# Altium schematic sheet Power Conversion.SchDoc
size Letter portrait; DocumentNumber: 1; SheetNumber: 1; SheetTotal: 13
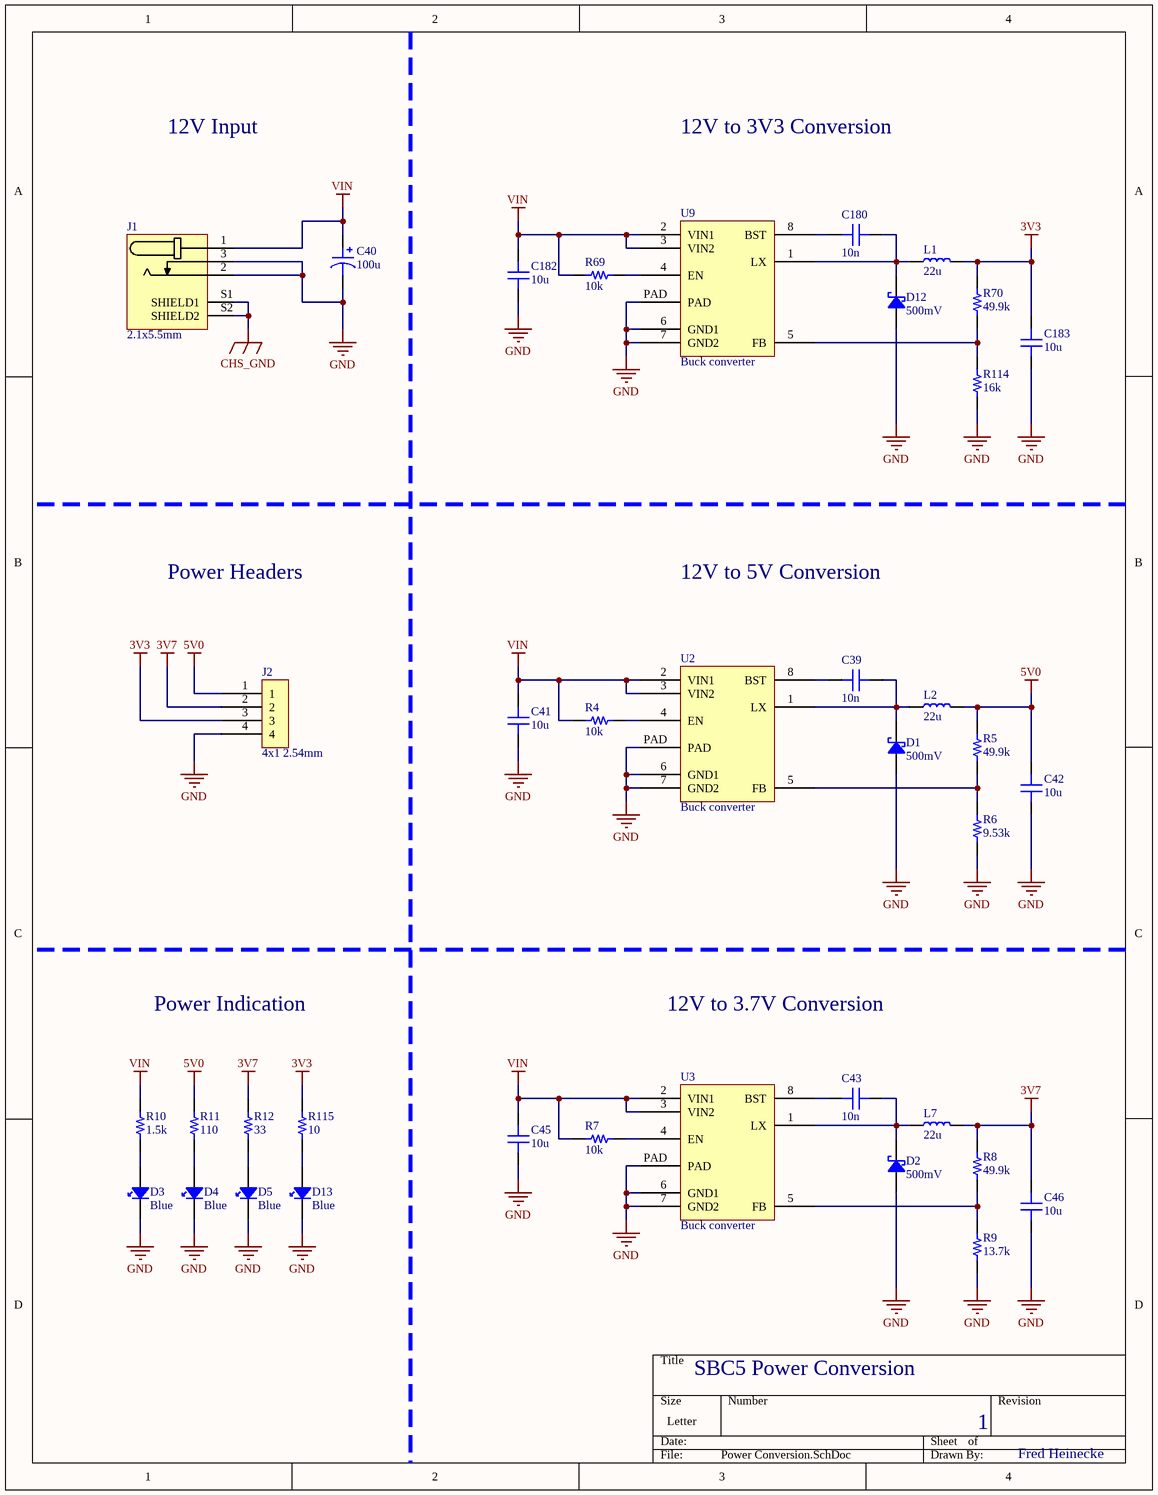
[diagram p0: Power Conversion.SchDoc]

## Parts
C39  10n  [C0402]
C40  100u  [C8x11.5x3.5]
C41  10u  [C0805]
C42  10u  [C0805]
C43  10n  [C0402]
C45  10u  [C0805]
C46  10u  [C0805]
C180  10n  [C0402]
C182  10u  [C0805]
C183  10u  [C0805]
D1  500mV  [SOD-123]
D2  500mV  [SOD-123]
D3  Blue  [D0603]
D4  Blue  [D0603]
D5  Blue  [D0603]
D12  500mV  [SOD-123]
D13  Blue  [D0603]
J1  2.1x5.5mm  [PJ-047AH]
J2  4x1 2.54mm  [PH1-04-UA]
L1  22u  [MPL-SE4030-220]
L2  22u  [MPL-SE4030-220]
L7  22u  [MPL-SE4030-220]
R4  10k  [R0201]
R5  49.9k  [R0603]
R6  9.53k  [R0603]
R7  10k  [R0201]
R8  49.9k  [R0603]
R9  13.7k  [R0603]
R10  1.5k  [R0402]
R11  110  [R0402]
R12  33  [R0402]
R69  10k  [R0201]
R70  49.9k  [R0603]
R114  16k  [R0603]
R115  10  [R0402]
U2  Buck converter  [AOZ1281DI]
U3  Buck converter  [AOZ1281DI]
U9  Buck converter  [AOZ1281DI]

## Nets
3V3: C183.2 J2.3 L1.2 R70.2 R115.2
3V7: C46.2 J2.2 L7.2 R8.2 R12.2
5V0: C42.2 J2.1 L2.2 R5.2 R11.2
CHS_GND: J1.S1(SHIELD1) J1.S2(SHIELD2)
GND: C40.2 C41.1 C42.1 C45.1 C46.1 C182.1 C183.1 D1.2 D2.2 D3.K D4.K D5.K D12.2 D13.K J1.2 J1.3 J2.4 R6.1 R9.1 R114.1 U2.6(GND1) U2.7(GND2) U2.PAD U3.6(GND1) U3.7(GND2) U3.PAD U9.6(GND1) U9.7(GND2) U9.PAD
VIN: C40.1 C41.2 C45.2 C182.2 J1.1 R4.1 R7.1 R10.2 R69.1 U2.2(VIN1) U2.3(VIN2) U3.2(VIN1) U3.3(VIN2) U9.2(VIN1) U9.3(VIN2)
NetC39_1: C39.1 U2.8(BST)
NetC39_2: C39.2 D1.1 L2.1 U2.1(LX)
NetC43_1: C43.1 U3.8(BST)
NetC43_2: C43.2 D2.1 L7.1 U3.1(LX)
NetC180_1: C180.1 U9.8(BST)
NetC180_2: C180.2 D12.1 L1.1 U9.1(LX)
NetD3_A: D3.A R10.1
NetD4_A: D4.A R11.1
NetD5_A: D5.A R12.1
NetD13_A: D13.A R115.1
NetR4_2: R4.2 U2.4(EN)
NetR5_1: R5.1 R6.2 U2.5(FB)
NetR7_2: R7.2 U3.4(EN)
NetR8_1: R8.1 R9.2 U3.5(FB)
NetR69_2: R69.2 U9.4(EN)
NetR70_1: R70.1 R114.2 U9.5(FB)

## Notes on the sheet
- 12V Input
- 12V to 3V3 Conversion
- Power Headers
- 12V to 5V Conversion
- Power Indication
- 12V to 3.7V Conversion
- SBC5 Power Conversion
- 1
- Fred Heinecke

## Library data of the parts
C39 C43 C180 = CL05B103KO5NNNC: SAMSUNG ELECTRO-MECHANICS - CL05B103KO5NNNC - SMD Multilayer Ceramic Capacitor, 0.01 µF, 16 V, 0402 [1005 Metric], ± 10%, X7R, CL Series; Capacitance: 10nF; Voltage Rating: 16V; Supplier 1: Digi-Key; Supplier Part Number 1: 1276-1051-1-ND; Manufacturer: Samsung; Manufacturer Part Number: CL05B103KO5NNNC; RoHS: Yes; Category: Ceramic Capacitors; Stock 1: 2979671; Pricing 1: 1=0.10000, 10=0.01600, 50=0.00880, 100=0.00710, 500=0.00508, 1000=0.00399, 2500=0.00363, 5000=0.00334 (USD); Mount: Surface Mount; Case/Package: 0402; Case Code (Metric): 1005; Case Code (Imperial): 0402; Material: Ceramic; Min Operating Temperature: -55°C; Max Operating Temperature: 125°C; Tolerance: 10%; Dielectric: X7R; Package Quantity: 1; Packaging: Tape and Reel; Voltage: 16V; Series: CL; Construction: Flat; Length: 1mm; Width: 0.02inch; Height: 0.5mm; Thickness: 0.022inch; Depth: 0.5mm; Radiation Hardening: No; RoHS Compliant: Yes; ComponentLink1URL: https://datasheet.ciiva.com/16199/cl05b103ko5nnnc-16199040.pdf?src-supplier=Future+Electronics; ComponentLink1Description: https://datasheet.ciiva.com/16199/cl05b103ko5nnnc-16199040.pdf?src-supplier=Future+Electronics; ComponentLink2URL: https://datasheet.ciiva.com/15195/getdatasheetpartid-358673-15195638.pdf?src-supplier=Verical; ComponentLink2Description: https://datasheet.ciiva.com/15195/getdatasheetpartid-358673-15195638.pdf?src-supplier=Verical; ComponentLink3URL: https://datasheet.ciiva.com/29198/458774-da-01-en-vs-kondensator-0402-29198435.pdf?src-supplier=Conrad; ComponentLink3Description: https://datasheet.ciiva.com/29198/458774-da-01-en-vs-kondensator-0402-29198435.pdf?src-supplier=Conrad; ComponentLink4URL: https://datasheet.ciiva.com/25806/cl05b103ko5nnnc-25806933.pdf?src-supplier=Digi-Key; ComponentLink4Description: https://datasheet.ciiva.com/25806/cl05b103ko5nnnc-25806933.pdf?src-supplier=Digi-Key
C40 = EEU-FM1H101: PANASONIC ELECTRONIC COMPONENTS - EEUFM1H101 - CAP, ALU ELEC, 100UF, 50V, RAD; Ripple Current: 870mA; Tolerance: 20%; Life (Hours): 3000Hour; ESR (Equivalent Series Resistance): 61mR; Polarity: Polar; Dissipation Factor: 0.1%; Lead Diameter: 0.6mm; Supplier 1: Newark; Manufacturer: Panasonic; Manufacturer Part Number: EEU-FM1H101; RoHS: Yes; Category: Aluminum Electrolytic Capacitors; Stock 1: 5906; Pricing 1: 1=0.42000, 10=0.29500, 50=0.20660, 100=0.17700, 500=0.13278, 1000=0.11212, 2500=0.10622, 5000=0.10032 (USD); Mount: Through Hole,PCB; Case/Package: Radial; Contact Plating: Tin; Min Operating Temperature: -40°C; Max Operating Temperature: 105°C; Capacitance: 100uF; Termination: Radial; Packaging: Bulk; Voltage Rating (DC): 50V; Package Quantity: 200; Voltage Rating: 50V; Impedance: 61mR; Voltage: 50V; Diameter: 8mm; Length: 11.5mm; Height: 11.5mm; Lead Pitch: 3.5mm; Height - Seated (Max): 0.512inch; Radiation Hardening: No; Lead Free: Lead Free; REACH SVHC: No SVHC; ComponentLink1URL: https://datasheet.ciiva.com/19479/1985569-19479304.pdf?src-supplier=Jameco; ComponentLink1Description: https://datasheet.ciiva.com/19479/1985569-19479304.pdf?src-supplier=Jameco; ComponentLink2URL: https://datasheet.ciiva.com/11777/0900766b805f3abe-11777837.pdf?src-supplier=RSComponents; ComponentLink2Description: https://datasheet.ciiva.com/11777/0900766b805f3abe-11777837.pdf?src-supplier=RSComponents; ComponentLink3URL: https://datasheet.ciiva.com/43454/1678946-43454655.pdf?src-supplier=Farnell; ComponentLink3Description: https://datasheet.ciiva.com/43454/1678946-43454655.pdf?src-supplier=Farnell; ComponentLink4URL: https://datasheet.ciiva.com/2984/aba0000ce108-2984065.pdf?src-supplier=Avnet; ComponentLink4Description: https://datasheet.ciiva.com/2984/aba0000ce108-2984065.pdf?src-supplier=Avnet; ComponentLink5URL: https://datasheet.ciiva.com/93/aba0000ce108-93030.pdf?src-supplier=Digi-Key; ComponentLink5Description: https://datasheet.ciiva.com/93/aba0000ce108-93030.pdf?src-supplier=Digi-Key; ComponentLink6URL: https://datasheet.ciiva.com/25899/aba0000ce108-25899433.pdf?src-supplier=Avnet+Europe; ComponentLink6Description: https://datasheet.ciiva.com/25899/aba0000ce108-25899433.pdf?src-supplier=Avnet+Europe; ComponentLink7URL: https://datasheet.ciiva.com/30233/aba0000ce108-30233323.pdf?src-supplier=Onlinecomponents.com; ComponentLink7Description: https://datasheet.ciiva.com/30233/aba0000ce108-30233323.pdf?src-supplier=Onlinecomponents.com; ComponentLink8URL: https://datasheet.ciiva.com/18442/70068540-18442844.pdf?src-supplier=Allied+Electronics; ComponentLink8Description: https://datasheet.ciiva.com/18442/70068540-18442844.pdf?src-supplier=Allied+Electronics; ComponentLink9URL: https://datasheet.ciiva.com/3773/41677975s7076861n1386-3773626.pdf?src-supplier=Arrow+Electronics; ComponentLink9Description: https://datasheet.ciiva.com/3773/41677975s7076861n1386-3773626.pdf?src-supplier=Arrow+Electronics; Supplier Part Number 1: 62W7950
C41 C42 C45 C46 C182 C183 = CL21A106KOQNNNE: SAMSUNG ELECTRO-MECHANICS - CL21A106KOQNNNE - SMD Multilayer Ceramic Capacitor, 10 µF, 16 V, 0805 [2012 Metric], ± 10%, X5R, CL Series; Capacitance: 10uF; Voltage Rating: 16V; Dielectric: X7R; Supplier 1: Digi-Key; Supplier Part Number 1: 1276-1096-1-ND; Manufacturer: Samsung; Manufacturer Part Number: CL21A106KOQNNNE; RoHS: Yes; Category: Ceramic Capacitors; Stock 1: 1393610; Pricing 1: 1=0.12000, 10=0.09000, 50=0.04900, 100=0.04000, 500=0.02860, 1000=0.02248 (USD); Mount: Surface Mount; Case/Package: 0805; Case Code (Metric): 2012; Case Code (Imperial): 0805; Min Operating Temperature: -55°C; Max Operating Temperature: 85°C; Package Quantity: 1; Packaging: Tape and Reel; Tolerance: 10%; Voltage Rating (DC): 16V; Series: CL; Construction: Flat; Voltage: 16V; Length: 2mm; Width: 0.049inch; Height: 1.25mm; Thickness: 0.055inch; Depth: 1.25mm; Radiation Hardening: No; Lead Free: Lead Free; RoHS Compliant: Yes; ComponentLink1URL: https://datasheet.ciiva.com/15216/getdatasheetpartid-358435-15216234.pdf?src-supplier=Verical; ComponentLink1Description: https://datasheet.ciiva.com/15216/getdatasheetpartid-358435-15216234.pdf?src-supplier=Verical; ComponentLink2URL: https://datasheet.ciiva.com/25798/cl21a106koqnnne-25798133.pdf?src-supplier=Digi-Key; ComponentLink2Description: https://datasheet.ciiva.com/25798/cl21a106koqnnne-25798133.pdf?src-supplier=Digi-Key; ComponentLink3URL: https://datasheet.ciiva.com/16740/cl05b104kq5nnnc-16740697.pdf?src-supplier=Future+Electronics; ComponentLink3Description: https://datasheet.ciiva.com/16740/cl05b104kq5nnnc-16740697.pdf?src-supplier=Future+Electronics
D1 D2 D12 = MBR230LSTR: Diode Schottky 30V 2A SOD123; Manufacturer: SMC; Supplier 1: Digi-Key; Supplier Part Number 1: 1655-2311-1-ND; Manufacturer Part Number: MBR230LSTR; RoHS: No; Stock 1: 21905; Pricing 1: 1=0.33000, 10=0.22900, 100=0.11180, 500=0.09322, 1000=0.06477 (USD); Mount: Surface Mount; Packaging: Tape and Reel; Max Reverse Voltage (DC): 30V; Average Rectified Current: 2A; ComponentLink1URL: http://www.smc-diodes.com/propdf/MBR230LS%20N1466%20REV.A.pdf?src-supplier=Digi-Key; ComponentLink1Description: http://www.smc-diodes.com/propdf/MBR230LS%20N1466%20REV.A.pdf?src-supplier=Digi-Key
D3-D5 D13 = 150060BS75000: WURTH ELEKTRONIK - 150060BS75000 - LED, Blau, Oberflächenmontage, 603, 30 mA, 3.2 V, 470 nm; Manufacturer: Wurth Electronics; Luminous Intensity: 145mcd; Forward Current: 30mA; Forward Voltage: 3.2V; Wavelength: 470nm; Viewing Angle: 140°; Lens Style: Clear,Rectangular; Test Current: 20mA; Supplier 1: Digi-Key; Supplier Part Number 1: 732-4966-1-ND; Manufacturer Part Number: 150060BS75000; RoHS: Yes; Category: LEDs; Stock 1: 49172; Pricing 1: 1=0.17000 (USD); Mount: Surface Mount; Case/Package: 0603; Color: Blue; Case Code (Metric): 1608; Case Code (Imperial): 0603; Min Operating Temperature: -40°C; Max Operating Temperature: 85°C; Package Quantity: 4000; Packaging: Cut Tape; Dominant Wavelength: 470nm; Length: 1.6mm; Width: 0.8mm; Height: 0.7mm; REACH SVHC: Unknown; RoHS Compliant: Yes; ComponentLink1URL: https://datasheet.ciiva.com/29563/150060bs75000-29563034.pdf?src-supplier=Digi-Key; ComponentLink1Description: https://datasheet.ciiva.com/29563/150060bs75000-29563034.pdf?src-supplier=Digi-Key; ComponentLink2URL: https://datasheet.ciiva.com/29279/759426-da-01-en-chipled-0603-w-kl-blau-150060bs75000-29279193.pdf?src-supplier=Conrad; ComponentLink2Description: https://datasheet.ciiva.com/29279/759426-da-01-en-chipled-0603-w-kl-blau-150060bs75000-29279193.pdf?src-supplier=Conrad; ComponentLink3URL: https://datasheet.ciiva.com/29563/150060bs75000-29563035.pdf?src-supplier=Digi-Key; ComponentLink3Description: https://datasheet.ciiva.com/29563/150060bs75000-29563035.pdf?src-supplier=Digi-Key; ComponentLink4URL: https://datasheet.ciiva.com/22656/1911343-22656939.pdf?src-supplier=Element14; ComponentLink4Description: https://datasheet.ciiva.com/22656/1911343-22656939.pdf?src-supplier=Element14; ComponentLink5URL: https://datasheet.ciiva.com/29563/150060bs75000-29563036.pdf?src-supplier=Digi-Key; ComponentLink5Description: https://datasheet.ciiva.com/29563/150060bs75000-29563036.pdf?src-supplier=Digi-Key; ComponentLink6URL: https://datasheet.ciiva.com/48430/150060bs75000-eng-tds-48430039.pdf?src-supplier=Distrelec; ComponentLink6Description: https://datasheet.ciiva.com/48430/150060bs75000-eng-tds-48430039.pdf?src-supplier=Distrelec
J1 = PJ-047AH: CONN PWR JACK 2.1X5.5MM SOLDER; Manufacturer: CUI; Gender: Male; Shielding: Shielded; Current Rating: 5A; Number of Conductors: 2; Voltage Rating: 24V; Insulation Resistance: 100MR; Supplier 1: Digi-Key; Supplier Part Number 1: CP-047AH-ND; Manufacturer Part Number: PJ-047AH; RoHS: Yes; Category: Connectors; Stock 1: 4559; Pricing 1: 1=0.80000, 10=0.70100, 25=0.66000, 50=0.63260, 100=0.60500, 250=0.55000, 500=0.49500, 1000=0.44000, 2500=0.39875 (USD); Mount: Through Hole; Color: Black; Contact Material: Copper,Brass; Contact Plating: Nickel; Housing Color: Black; Housing Material: Thermoplastic; Min Operating Temperature: -25°C; Max Operating Temperature: 85°C; Termination: Solder; Connector Type: Jack; Package Quantity: 500; Contact Gender: Male; Orientation: Horizontal; Series: -; Lead Free: Lead Free; Flammability Rating: UL94 V-0; RoHS Compliant: Yes; ComponentLink1URL: http://www.mouser.com/ds/2/670/PJ-047AH-524157.pdf?src-supplier=Mouser; ComponentLink1Description: http://www.mouser.com/ds/2/670/PJ-047AH-524157.pdf?src-supplier=Mouser; ComponentLink2URL: https://www.cui.com/product/resource/digikeypdf/pj-047ah.pdf?src-supplier=Digi-Key; ComponentLink2Description: https://www.cui.com/product/resource/digikeypdf/pj-047ah.pdf?src-supplier=Digi-Key; Supplier 2: Digi-Key; Supplier Part Number 2: CP-047A-ND; Supplier 3: Arrow Electronics; Supplier Part Number 3: PJ-047A; Supplier 4: Mouser; Supplier Part Number 4: 490-PJ-047A
J2 = PH1-04-UA: Conn Unshrouded Header HDR 4 POS 2.54mm Solder ST Thru-Hole Bag; Manufacturer: Adam Equipment; Number of Positions: 4; Supplier 1: Digi-Key; Supplier Part Number 1: 2057-PH1-04-UA-ND; Manufacturer Part Number: PH1-04-UA; RoHS: Yes; Category: Connectors; Stock 1: 1152; Pricing 1: 1=0.10000, 10=0.07200, 100=0.04440, 500=0.03672, 1000=0.03213, 5000=0.02754, 10000=0.02678 (USD); Termination: Through Hole; Pitch: 2.54mm; Lead Free: Lead Free; ComponentLink1URL: http://www.adam-tech.com/catalog/2010/page_292-295.pdf?src-supplier=Future+Electronics; ComponentLink1Description: http://www.adam-tech.com/catalog/2010/page_292-295.pdf?src-supplier=Future+Electronics; ComponentLink2Description: Datasheet; ComponentLink2URL: https://static6.arrow.com/aropdfconversion/683efa088b5c0b1a8da3df70e12f05ed3743b8bf/page_292.pdf; ComponentLink3Description: Mechanical drawing; ComponentLink3URL: http://www.adam-tech.com/upload/PH1-XX-UA.pdf
L1 L2 L7 = MPL-SE4030-220: FIXED IND 22UH 1.5A 219 MOHM SMD; Manufacturer: Monolithic Power Systems; Supplier 1: Digi-Key; Supplier Part Number 1: 1589-MPL-SE4030-220CT-ND; Manufacturer Part Number: MPL-SE4030-220; RoHS: No; ComponentLink1Description: Datasheet; ComponentLink1URL: https://www.monolithicpower.com/en/documentview/productdocument/index/version/2/document_type/Datasheet/lang/en/sku/MPL-SE4030-220/document_id/5899/; Supplier 2: Mouser; Supplier Part Number 2: 946-MPL-SE4030-220
R4 R7 R69 = RMCF0201FT10K0: RES 10K OHM 1% 1/20W 0201; Manufacturer: Stackpole Electronics; Max Power Dissipation: 50mW; Temperature Coefficient: 200ppm/°C; Resistance: 10kR; Supplier 1: Digi-Key; Manufacturer Part Number: RMCF0201FT10K0; RoHS: Yes; Category: Chip SMD Resistors; Stock 1: 1526173; Pricing 1: 1=0.10000, 10=0.02300, 100=0.00940, 1000=0.00424, 2500=0.00368, 5000=0.00304 (USD); Mount: Surface Mount; Case/Package: 0201; Contact Plating: Tin,Matte; Case Code (Imperial): 0201; Case Code (Metric): 0603; Min Operating Temperature: -55°C; Max Operating Temperature: 125°C; Resistor Type: Thick Film; Number of Terminations: 2; Packaging: Tape and Reel; Tolerance: 1%; Power Rating: 50mW; Length: 0.024inch; Width: 0.012inch; Height: 0.009inch; ComponentLink1URL: https://www.seielect.com/catalog/SEI-Packaging.pdf?src-supplier=Digi-Key; ComponentLink1Description: https://www.seielect.com/catalog/SEI-Packaging.pdf?src-supplier=Digi-Key; ComponentLink2URL: https://www.seielect.com/Catalog/SEI-RMCF_RMCP.pdf?src-supplier=Avnet+Asia; ComponentLink2Description: https://www.seielect.com/Catalog/SEI-RMCF_RMCP.pdf?src-supplier=Avnet+Asia; ComponentLink3URL: https://www.seielect.com/Catalog/SEI-RMCF_RMCP.pdf?src-supplier=Avnet; ComponentLink3Description: https://www.seielect.com/Catalog/SEI-RMCF_RMCP.pdf?src-supplier=Avnet; ComponentLink4URL: https://www.seielect.com/Catalog/SEI-RMCF_RMCP.pdf?src-supplier=Digi-Key; ComponentLink4Description: https://www.seielect.com/Catalog/SEI-RMCF_RMCP.pdf?src-supplier=Digi-Key; Supplier Part Number 1: RMCF0201FT10K0CT-ND
R5 R8 R70 = ERA-3AEB4992V: RES SMD 49.9KOHM 0.1% 1/10W 0603; Manufacturer: Panasonic; Resistance: 49.9kR; Temperature Coefficient: 25ppm/°C; Power Rating: 100mW; Voltage Rating: 75V; Supplier 1: Digi-Key; Manufacturer Part Number: ERA-3AEB4992V; RoHS: Yes; Category: Chip SMD Resistors; Stock 1: 25051; Pricing 1: 1=0.31000, 10=0.26000, 100=0.10150, 1000=0.04248, 2500=0.03894 (USD); Mount: Surface Mount; Case/Package: 0603; Number of Pins: 2; Contact Plating: Tin; Case Code (Metric): 1608; Case Code (Imperial): 0603; Min Operating Temperature: -55°C; Max Operating Temperature: 155°C; Tolerance: 0.1%; Resistor Type: Thin Film,Metal Film; Packaging: Tape and Reel; Package Quantity: 1; Number of Terminations: 2; Termination: SMD/SMT; Max Power Dissipation: 100mW; Voltage Rating (DC): 75V; Features: Automotive AEC-Q200; Length: 1.6mm; Width: 0.8mm; Height: 0.45mm; Depth: 0.8mm; Radiation Hardening: No; REACH SVHC: No SVHC; Military Standard: Not; Lead Free: Lead Free; ComponentLink1URL: https://datasheet.ciiva.com/11812/0900766b80eb1d8c-11812018.pdf?src-supplier=RSComponents; ComponentLink1Description: https://datasheet.ciiva.com/11812/0900766b80eb1d8c-11812018.pdf?src-supplier=RSComponents; ComponentLink2URL: https://datasheet.ciiva.com/29183/451874-da-01-en-widerstand-0603-era-29183904.pdf?src-supplier=Conrad; ComponentLink2Description: https://datasheet.ciiva.com/29183/451874-da-01-en-widerstand-0603-era-29183904.pdf?src-supplier=Conrad; ComponentLink3URL: https://datasheet.ciiva.com/5998/485442-5998330.pdf?src-supplier=Farnell; ComponentLink3Description: https://datasheet.ciiva.com/5998/485442-5998330.pdf?src-supplier=Farnell; ComponentLink4URL: https://datasheet.ciiva.com/7861/485442-7861691.pdf?src-supplier=Element14; ComponentLink4Description: https://datasheet.ciiva.com/7861/485442-7861691.pdf?src-supplier=Element14; ComponentLink5URL: https://datasheet.ciiva.com/5998/485442-5998334.pdf?src-supplier=Farnell; ComponentLink5Description: https://datasheet.ciiva.com/5998/485442-5998334.pdf?src-supplier=Farnell; ComponentLink6URL: https://datasheet.ciiva.com/30157/54aoa0000ce26-30157031.pdf?src-supplier=Onlinecomponents.com; ComponentLink6Description: https://datasheet.ciiva.com/30157/54aoa0000ce26-30157031.pdf?src-supplier=Onlinecomponents.com; ComponentLink7URL: https://datasheet.ciiva.com/5998/485442-5998332.pdf?src-supplier=Farnell; ComponentLink7Description: https://datasheet.ciiva.com/5998/485442-5998332.pdf?src-supplier=Farnell; ComponentLink8URL: https://datasheet.ciiva.com/46422/485442-46422700.pdf?src-supplier=Element14; ComponentLink8Description: https://datasheet.ciiva.com/46422/485442-46422700.pdf?src-supplier=Element14; Supplier Part Number 1: P49.9KDBCT-ND; Supplier 2: Arrow Electronics; Supplier Part Number 2: ERA-3AEB4992V; Supplier 3: Mouser; Supplier Part Number 3: 667-ERA-3AEB4992V
R6 = ERA-3AEB9531V: RES SMD 9.53KOHM 0.1% 1/10W 0603; Manufacturer: Panasonic; Temperature Coefficient: 25ppm/°C; Resistance: 9.53kR; Voltage Rating (DC): 75V; Power Rating: 100mW; Supplier 1: Digi-Key; Manufacturer Part Number: ERA-3AEB9531V; RoHS: Yes; Category: Chip SMD Resistors; Stock 1: 27415; Pricing 1: 1=0.31000, 10=0.26000, 100=0.10150, 1000=0.04248, 2500=0.03894 (USD); Mount: Surface Mount; Case/Package: 0603; Number of Pins: 2; Contact Plating: Tin; Case Code (Imperial): 0603; Case Code (Metric): 1608; Min Operating Temperature: -55°C; Max Operating Temperature: 155°C; Resistor Type: Metal Film,Thin Film; Tolerance: 0.1%; Number of Terminations: 2; Features: Automotive AEC-Q200; Voltage Rating: 75V; Package Quantity: 5000; Packaging: Tape and Reel; Max Power Dissipation: 100mW; Length: 1.6mm; Width: 0.8mm; Height: 0.45mm; Depth: 0.8mm; Radiation Hardening: No; Military Standard: Not; Lead Free: Lead Free; ComponentLink1URL: https://datasheet.ciiva.com/11811/0900766b80eb1d8c-11811912.pdf?src-supplier=RSComponents; ComponentLink1Description: https://datasheet.ciiva.com/11811/0900766b80eb1d8c-11811912.pdf?src-supplier=RSComponents; ComponentLink2URL: https://datasheet.ciiva.com/29184/452443-da-01-en-widerstand-0603-era-29184006.pdf?src-supplier=Conrad; ComponentLink2Description: https://datasheet.ciiva.com/29184/452443-da-01-en-widerstand-0603-era-29184006.pdf?src-supplier=Conrad; ComponentLink3URL: https://datasheet.ciiva.com/5987/485442-5987161.pdf?src-supplier=Farnell; ComponentLink3Description: https://datasheet.ciiva.com/5987/485442-5987161.pdf?src-supplier=Farnell; ComponentLink4URL: https://datasheet.ciiva.com/7829/485442-7829102.pdf?src-supplier=Element14; ComponentLink4Description: https://datasheet.ciiva.com/7829/485442-7829102.pdf?src-supplier=Element14; ComponentLink5URL: https://datasheet.ciiva.com/9194/aoa0000ce26-9194167.pdf?src-supplier=Avnet; ComponentLink5Description: https://datasheet.ciiva.com/9194/aoa0000ce26-9194167.pdf?src-supplier=Avnet; ComponentLink6URL: https://datasheet.ciiva.com/5987/485442-5987164.pdf?src-supplier=Farnell; ComponentLink6Description: https://datasheet.ciiva.com/5987/485442-5987164.pdf?src-supplier=Farnell; ComponentLink7URL: https://datasheet.ciiva.com/5987/485442-5987166.pdf?src-supplier=Farnell; ComponentLink7Description: https://datasheet.ciiva.com/5987/485442-5987166.pdf?src-supplier=Farnell; Supplier Part Number 1: P9.53KDBCT-ND
R9 = ERJ-PB3B1372V: RES SMD 13.7K OHM 0.1% 1/5W 0603; Manufacturer: Panasonic; Max Power Dissipation: 200mW; Temperature Coefficient: 50ppm/°C; Resistance: 13.7kR; Supplier 1: Digi-Key; Manufacturer Part Number: ERJ-PB3B1372V; RoHS: Yes; Category: Chip SMD Resistors; Stock 1: 5380; Pricing 1: 1=0.23000, 10=0.19100, 25=0.13920, 50=0.10100, 100=0.07480, 250=0.05744, 500=0.04524, 1000=0.03132 (USD); Case/Package: 0603; Case Code (Imperial): 0603; Case Code (Metric): 1608; Min Operating Temperature: -55°C; Max Operating Temperature: 155°C; Features: Automotive AEC-Q200; Tolerance: 0.1%; Packaging: Tape and Reel; Resistor Type: Thick Film; Number of Terminations: 2; Length: 0.063inch; Width: 0.032inch; Height - Seated (Max): 0.022inch; ComponentLink1URL: https://industrial.panasonic.com/cdbs/www-data/pdf/RDM0000/DMM0000COL5.pdf?src-supplier=Digi-Key; ComponentLink1Description: https://industrial.panasonic.com/cdbs/www-data/pdf/RDM0000/DMM0000COL5.pdf?src-supplier=Digi-Key; ComponentLink2URL: https://industrial.panasonic.com/sa/system/files/data/download/catalog/id_fixed-resistors_e_2.pdf?src-supplier=Digi-Key; ComponentLink2Description: https://industrial.panasonic.com/sa/system/files/data/download/catalog/id_fixed-resistors_e_2.pdf?src-supplier=Digi-Key; Supplier Part Number 1: P20100CT-ND
R10 = RMCF0402FT1K50: RES 1.5K OHM 1% 1/16W 0402; Manufacturer: Stackpole Electronics; Resistance: 1.5kR; Power Rating: 62.5mW; Max Power Dissipation: 63mW; Temperature Coefficient: 100ppm/°C; Supplier 1: Digi-Key; Supplier Part Number 1: RMCF0402FT1K50CT-ND; Manufacturer Part Number: RMCF0402FT1K50; RoHS: Yes; Category: Chip SMD Resistors; Stock 1: 378149; Pricing 1: 1=0.10000, 10=0.01300, 100=0.00530, 1000=0.00239, 2500=0.00207, 5000=0.00171 (USD); Mount: Surface Mount; Case/Package: 0402; Case Code (Imperial): 0402; Contact Plating: Tin,Matte; Case Code (Metric): 1005; Min Operating Temperature: -55°C; Max Operating Temperature: 155°C; Tolerance: 1%; Packaging: Tape and Reel; Resistor Type: Thick Film; Number of Terminations: 2; Features: Automotive AEC-Q200; Length: 0.039inch; Width: 0.02inch; Height: 0.016inch; Radiation Hardening: No; Lead Free: Lead Free; ComponentLink1URL: http://components.arrow.com/part/dataview/44988063S7520342N1174?src-supplier=Arrow+Electronics; ComponentLink1Description: http://components.arrow.com/part/dataview/44988063S7520342N1174?src-supplier=Arrow+Electronics; ComponentLink2URL: https://www.seielect.com/catalog/SEI-Packaging.pdf?src-supplier=Digi-Key; ComponentLink2Description: https://www.seielect.com/catalog/SEI-Packaging.pdf?src-supplier=Digi-Key; ComponentLink3URL: https://www.seielect.com/catalog/SEI-RMCF_RMCP.pdf?src-supplier=Avnet+Asia; ComponentLink3Description: https://www.seielect.com/catalog/SEI-RMCF_RMCP.pdf?src-supplier=Avnet+Asia; ComponentLink4URL: https://www.seielect.com/catalog/SEI-RMCF_RMCP.pdf?src-supplier=Avnet; ComponentLink4Description: https://www.seielect.com/catalog/SEI-RMCF_RMCP.pdf?src-supplier=Avnet
R11 = RMCF0402FT110R: Res Thick Film 0402 110 Ohm 1% 0.063W(1/16W) ±100ppm/C Pad SMD Automotive T/R; Manufacturer: Stackpole Electronics; Resistance: 110R; Max Power Dissipation: 63mW; Temperature Coefficient: 100ppm/°C; Supplier 1: Digi-Key; Supplier Part Number 1: RMCF0402FT110RCT-ND; Manufacturer Part Number: RMCF0402FT110R; RoHS: Yes; Category: Chip SMD Resistors; Stock 1: 98158; Pricing 1: 1=0.10000, 10=0.01300, 100=0.00530, 1000=0.00239, 2500=0.00207, 5000=0.00171 (USD); Mount: Surface Mount; Case/Package: 0402; Case Code (Metric): 1005; Case Code (Imperial): 0402; Contact Plating: Tin,Matte; Min Operating Temperature: -55°C; Max Operating Temperature: 155°C; Packaging: Tape and Reel; Tolerance: 1%; Package Quantity: 1; Resistor Type: Thick Film; Number of Terminations: 2; Features: Automotive AEC-Q200; Series: RMCF; Length: 0.039inch; Width: 0.02inch; Height: 0.016inch; Lead Free: Lead Free; RoHS Compliant: Yes; ComponentLink1URL: https://www.seielect.com/Catalog/SEI-RMCF_RMCP.pdf?src-supplier=Avnet; ComponentLink1Description: https://www.seielect.com/Catalog/SEI-RMCF_RMCP.pdf?src-supplier=Avnet; ComponentLink2URL: https://www.seielect.com/Catalog/SEI-RMCF_RMCP.pdf?src-supplier=Digi-Key; ComponentLink2Description: https://www.seielect.com/Catalog/SEI-RMCF_RMCP.pdf?src-supplier=Digi-Key; ComponentLink3URL: https://www.seielect.com/catalog/SEI-Packaging.pdf?src-supplier=Digi-Key; ComponentLink3Description: https://www.seielect.com/catalog/SEI-Packaging.pdf?src-supplier=Digi-Key
R12 = RMCF0402FT33R0: RES 33 OHM 1% 1/16W 0402; Manufacturer: Stackpole Electronics; Resistance: 33R; Max Power Dissipation: 63mW; Temperature Coefficient: 100ppm/°C; Supplier 1: Digi-Key; Supplier Part Number 1: RMCF0402FT33R0CT-ND; Manufacturer Part Number: RMCF0402FT33R0; RoHS: Yes; Category: Chip SMD Resistors; Stock 1: 993457; Pricing 1: 1=0.10000, 10=0.01300, 100=0.00530, 1000=0.00239, 2500=0.00207, 5000=0.00171 (USD); Mount: Surface Mount; Case/Package: 0402; Case Code (Metric): 1005; Case Code (Imperial): 0402; Contact Plating: Tin,Matte; Min Operating Temperature: -55°C; Max Operating Temperature: 155°C; Features: Automotive AEC-Q200; Package Quantity: 1; Resistor Type: Thick Film; Number of Terminations: 2; Packaging: Tape and Reel; Tolerance: 1%; Length: 0.039inch; Width: 0.02inch; Height: 0.016inch; Radiation Hardening: No; Lead Free: Lead Free; ComponentLink1URL: https://www.seielect.com/catalog/SEI-RMCF_RMCP.pdf?src-supplier=Avnet; ComponentLink1Description: https://www.seielect.com/catalog/SEI-RMCF_RMCP.pdf?src-supplier=Avnet; ComponentLink2URL: https://www.seielect.com/catalog/SEI-Packaging.pdf?src-supplier=Digi-Key; ComponentLink2Description: https://www.seielect.com/catalog/SEI-Packaging.pdf?src-supplier=Digi-Key; ComponentLink3URL: https://www.seielect.com/Catalog/SEI-RMCF_RMCP.pdf?src-supplier=Digi-Key; ComponentLink3Description: https://www.seielect.com/Catalog/SEI-RMCF_RMCP.pdf?src-supplier=Digi-Key
R114 = RMCF0603FT16K0: RES SMD 16K OHM 1% 1/10W 0603; Manufacturer: Stackpole Electronics; Resistance: 16kR; Max Power Dissipation: 100mW; Temperature Coefficient: 100ppm/°C; Supplier 1: Arrow Electronics; Supplier Part Number 1: RMCF0603FT16K0; Manufacturer Part Number: RMCF0603FT16K0; RoHS: Yes; Category: Chip SMD Resistors; Mount: Surface Mount; Case/Package: 0603; Case Code (Metric): 1608; Case Code (Imperial): 0603; Contact Plating: Tin,Matte; Min Operating Temperature: -55°C; Max Operating Temperature: 155°C; Packaging: Tape and Reel; Tolerance: 1%; Resistor Type: Thick Film; Number of Terminations: 2; Features: Automotive AEC-Q200; Series: RMCF; Length: 0.061inch; Width: 0.031inch; Height: 0.022inch; Radiation Hardening: No; Lead Free: Lead Free; RoHS Compliant: Yes; ComponentLink1URL: http://components.arrow.com/part/dataview/50862390S111928N1174?src-supplier=Arrow+Electronics; ComponentLink1Description: http://components.arrow.com/part/dataview/50862390S111928N1174?src-supplier=Arrow+Electronics; ComponentLink2URL: https://www.seielect.com/catalog/SEI-RMCF_RMCP.pdf?src-supplier=Avnet; ComponentLink2Description: https://www.seielect.com/catalog/SEI-RMCF_RMCP.pdf?src-supplier=Avnet; ComponentLink3URL: https://www.seielect.com/Catalog/SEI-RMCF_RMCP.pdf?src-supplier=Digi-Key; ComponentLink3Description: https://www.seielect.com/Catalog/SEI-RMCF_RMCP.pdf?src-supplier=Digi-Key; ComponentLink4URL: https://www.seielect.com/catalog/SEI-Packaging.pdf?src-supplier=Digi-Key; ComponentLink4Description: https://www.seielect.com/catalog/SEI-Packaging.pdf?src-supplier=Digi-Key
R115 = RMCF0402FT10R0: RES 10 OHM 1% 1/16W 0402; Manufacturer: Stackpole Electronics; Resistance: 10R; Power Rating: 63mW; Temperature Coefficient: 100ppm/°C; Supplier 1: Digi-Key; Supplier Part Number 1: RMCF0402FT10R0CT-ND; Manufacturer Part Number: RMCF0402FT10R0; RoHS: Yes; Category: Chip SMD Resistors; Stock 1: 588325; Pricing 1: 1=0.10000, 10=0.01300, 100=0.00530, 1000=0.00239, 2500=0.00207, 5000=0.00171 (USD); Mount: Surface Mount; Case/Package: 0402; Contact Plating: Tin,Matte; Case Code (Imperial): 0402; Case Code (Metric): 1005; Min Operating Temperature: -55°C; Max Operating Temperature: 155°C; Tolerance: 1%; Packaging: Tape and Reel; Max Power Dissipation: 63mW; Features: Automotive AEC-Q200; Resistor Type: Thick Film; Number of Terminations: 2; Length: 1mm; Width: 0.02inch; Height: 0.016inch; Depth: 0.5mm; Radiation Hardening: No; Lead Free: Lead Free; Military Standard: Not; ComponentLink1URL: http://components.arrow.com/part/dataview/44988361S6966751N1174?src-supplier=Arrow+Electronics; ComponentLink1Description: http://components.arrow.com/part/dataview/44988361S6966751N1174?src-supplier=Arrow+Electronics; ComponentLink2URL: https://www.seielect.com/catalog/SEI-RMCF_RMCP.pdf?src-supplier=Avnet; ComponentLink2Description: https://www.seielect.com/catalog/SEI-RMCF_RMCP.pdf?src-supplier=Avnet; ComponentLink3URL: https://www.seielect.com/catalog/SEI-Packaging.pdf?src-supplier=Digi-Key; ComponentLink3Description: https://www.seielect.com/catalog/SEI-Packaging.pdf?src-supplier=Digi-Key; ComponentLink4URL: http://www.seielect.com/Catalog/SEI-RMCF_RMCP.pdf?src-supplier=Future+Electronics; ComponentLink4Description: http://www.seielect.com/Catalog/SEI-RMCF_RMCP.pdf?src-supplier=Future+Electronics
U2 U3 U9 = AOZ1281DI: Conv DC-DC 3V to 26V Step Down Single-Out 0.8V to 22.1V 1.8A 8-Pin DFN EP T/R; Manufacturer: Alpha & Omega Semiconductor; Number of Outputs: 1; Efficiency: 95%; Min Output Voltage: 800mV; Switching Frequency: 1.5MHz; Synchronous Rectifier: No; Output Type: Adjustable; Output Configuration: Positive; Supplier 1: Digi-Key; Supplier Part Number 1: 785-1276-1-ND; Manufacturer Part Number: AOZ1281DI; RoHS: Yes; Category: Voltage Regulators - Switching; Stock 1: 15925; Pricing 1: 1=0.81000, 10=0.71400, 25=0.67040, 100=0.50820, 250=0.43248, 500=0.41086, 1000=0.31355 (USD); Mount: Surface Mount; Case/Package: DFN; Number of Pins: 8; Min Operating Temperature: -40°C; Max Operating Temperature: 85°C; Output Current: 1.8A; Packaging: Tape and Reel; Min Input Voltage: 3V; Max Input Voltage: 26V; Max Output Voltage: 22.1V; Series: EZBuck™; RoHS Compliant: Yes; ComponentLink1URL: https://datasheet.ciiva.com/2028/aoz1281di-2028092.pdf?src-supplier=Digi-Key; ComponentLink1Description: https://datasheet.ciiva.com/2028/aoz1281di-2028092.pdf?src-supplier=Digi-Key; ComponentLink2URL: https://datasheet.ciiva.com/2028/aoz1281di-2028093.pdf?src-supplier=Digi-Key; ComponentLink2Description: https://datasheet.ciiva.com/2028/aoz1281di-2028093.pdf?src-supplier=Digi-Key; ComponentLink3URL: https://datasheet.ciiva.com/2028/aoz1281di-2028094.pdf?src-supplier=Digi-Key; ComponentLink3Description: https://datasheet.ciiva.com/2028/aoz1281di-2028094.pdf?src-supplier=Digi-Key